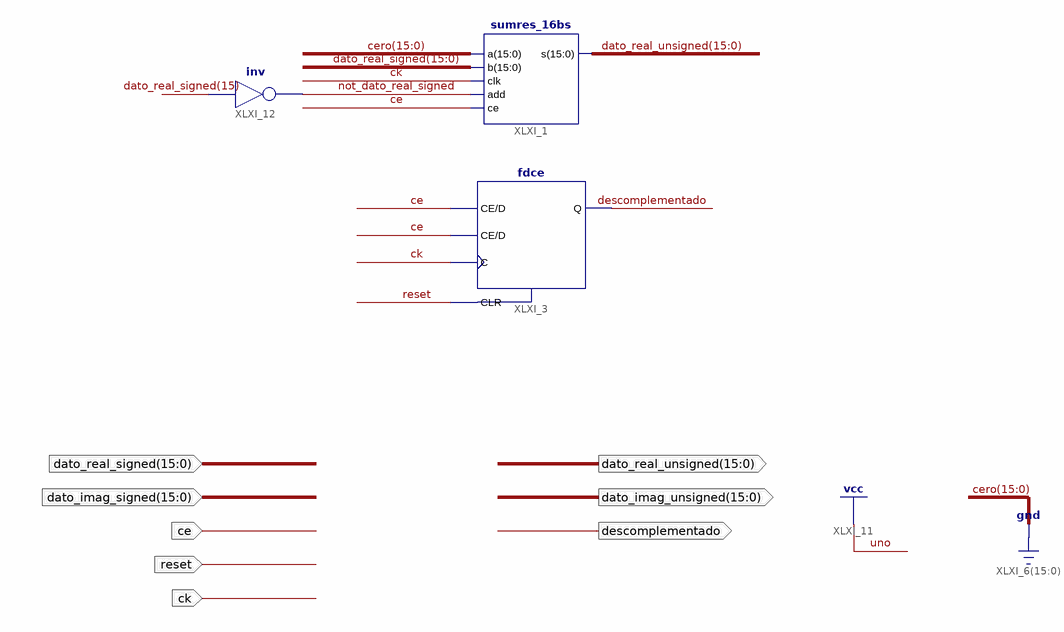
[diagram p0: schematic sheet 1]
// Xilinx ISE schematic descomplementador_a_dos.sch (spartan6) as structural Verilog: 3 symbols, 8 ports
module descomplementador_a_dos (
  input  ck,
  input  [15:0] dato_real_signed,
  input  reset,
  input  [15:0] dato_imag_signed,
  input  ce,
  output [15:0] dato_real_unsigned,
  output [15:0] dato_imag_unsigned,
  output descomplementado
);

  wire not_dato_real_signed;

  sumres_16bs XLXI_1 (
    .a({16{1'b0}}), .b(dato_real_signed), .clk(ck), .add(not_dato_real_signed), .ce(ce),
    .s(dato_real_unsigned));
  fdce XLXI_3 (.C(ck), .CE(ce), .CLR(reset), .D(ce), .Q(descomplementado));
  not XLXI_12 (not_dato_real_signed, dato_real_signed[15]);
endmodule
